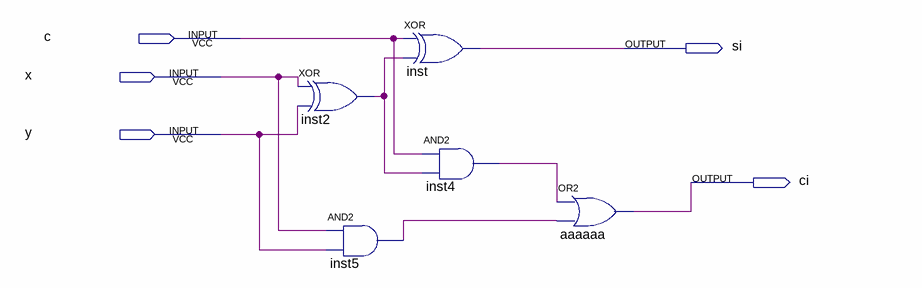
[diagram p0: schematic sheet]
// Quartus schematic aula5.bdf as structural Verilog: 5 symbols, 5 pins
module aula5 (
  input  c,
  input  x,
  input  y,
  output si,
  output ci
);

  wire inst2_out, inst4_out, inst5_out;

  xor inst2 (inst2_out, x, y);
  and inst5 (inst5_out, x, y);
  xor inst (si, c, inst2_out);
  and inst4 (inst4_out, c, inst2_out);
  or aaaaaa (ci, inst4_out, inst5_out);
endmodule
